# EAGLE schematic SmartRock_4-pin_EC_Breakout-v4 (EAGLE 9.6.2)
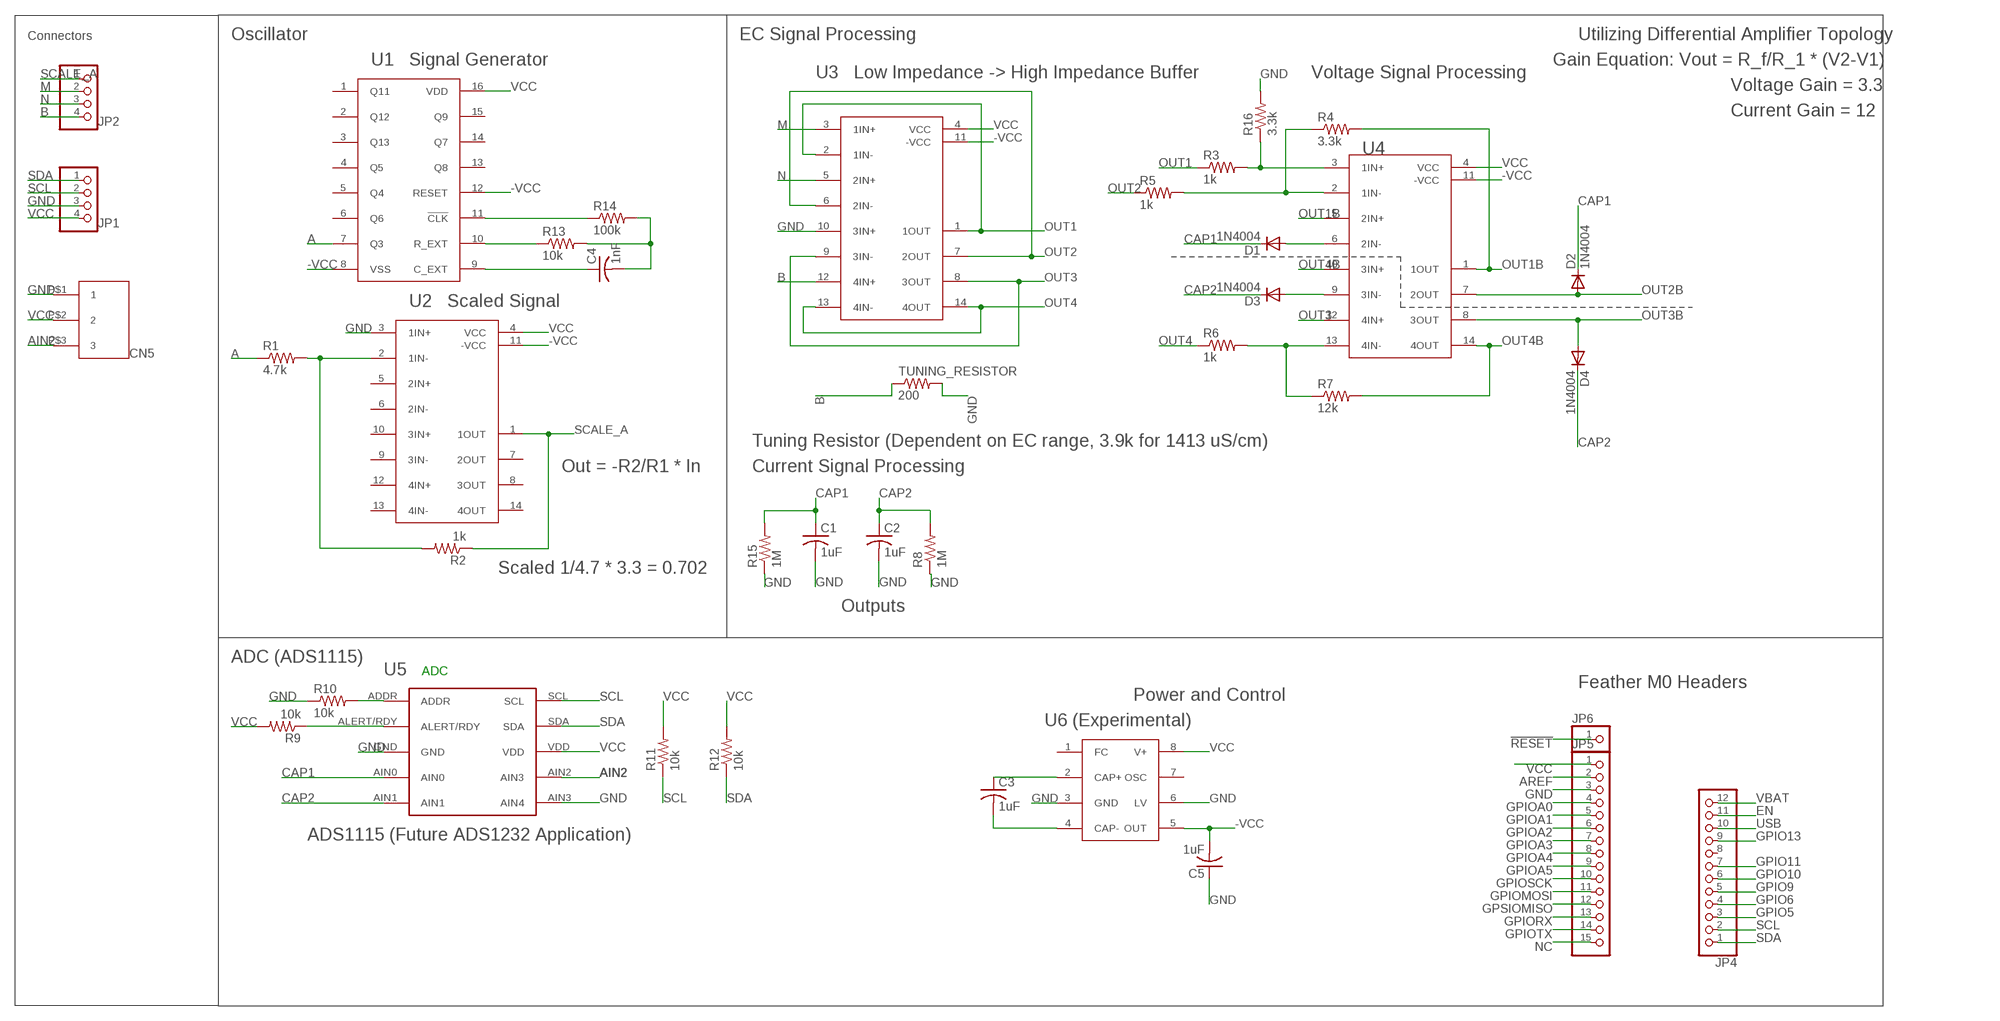
[diagram p0: schematic, sheet 1]

## Parts
C1  1uF  C-US025-024X044  [C025-024X044]
C2  1uF  C-US025-024X044  [C025-024X044]
C3  1uF  C-US025-024X044  [C025-024X044]
C4  1nF  C-USC1206  [C1206]
C5  1uF  C-US025-024X044  [C025-024X044]
CN2  JST_3PIN_2MM  [JST_3PIN_2MM]
D1  1N4004  [DO41-10]
D2  1N4004  [DO41-10]
D3  1N4004  [DO41-10]
D4  1N4004  [DO41-10]
JP1  PINHD-1X4  [1X04]
JP2  PINHD-1X4  [1X04]
JP4  PINHD-1X12-CB  [1X12-CB]
JP5  PINHD-1X15-CB  [1X15-CB]
JP6  PINHD-1X1CB  [1X01-CLEANBIG]
R1  4.7k  R-US_M1206  [M1206]
R2  1k  R-US_M1206  [M1206]
R3  1k  R-US_M1206  [M1206]
R4  3.3k  R-US_M1206  [M1206]
R5  1k  R-US_M1206  [M1206]
R6  1k  R-US_M1206  [M1206]
R7  12k  R-US_M1206  [M1206]
R8  1M  R-US_M1206  [M1206]
R9  10k  R-US_M1206  [M1206]
R10  10k  R-US_M1206  [M1206]
R11  10k  R-US_M1206  [M1206]
R12  10k  R-US_M1206  [M1206]
R13  10k  R-US_M1206  [M1206]
R14  100k  R-US_M1206  [M1206]
R15  1M  R-US_M1206  [M1206]
R16  3.3k  R-US_M1206  [M1206]
TUNING_RESISTOR  200  R-US_M1206  [M1206]
U1  CD4060BPWR  [CD4060BPWR]
U2  TL074CPWR  [LT074CPWR]
U3  TL074CPWR  [LT074CPWR]
U4  TL074CPWR  [LT074CPWR]
U5  ADS1115  [ADS1115]
U6+  MAX660MX/NOPB  [MAX660MX/NOPB]

## Nets
!RESET: JP6.1
-VCC: C5.2 U1.8(VSS) U1.12(RESET) U2.11(-VCC) U3.11(-VCC) U4.11(-VCC) U6+.5(OUT)
A: R1.1 U1.7(Q3)
AIN2: CN2.P$3 U5.AIN2(AIN3)
AREF: JP5.2
B: JP2.4 TUNING_RESISTOR.1 U3.12(4IN+)
CAP1: C1.1 D1.C D2.C R15.2 U5.AIN0
CAP2: C2.1 D3.C D4.C R8.2 U5.AIN1
EN: JP4.11
GND: C1.2 C2.2 C5.1 CN2.P$1 JP1.3 JP5.3 R8.1 R10.1 R15.1 R16.2 TUNING_RESISTOR.2 U2.3(1IN+) U3.10(3IN+) U5.AIN3(AIN4) U5.GND U6+.3(GND) U6+.6(LV)
GPIO5: JP4.3
GPIO6: JP4.4
GPIO9: JP4.5
GPIO10: JP4.6
GPIO11: JP4.7
GPIO13: JP4.9
GPIOA0: JP5.4
GPIOA1: JP5.5
GPIOA2: JP5.6
GPIOA3: JP5.7
GPIOA4: JP5.8
GPIOA5: JP5.9
GPIOMOSI: JP5.11
GPIORX: JP5.13
GPIOSCK: JP5.10
GPIOTX: JP5.14
GPSIOMISO: JP5.12
M: JP2.2 U3.3(1IN+)
N: JP2.3 U3.5(2IN+)
N$1: R3.2 R16.1 U4.3(1IN+)
N$2: R4.1 R5.2 U4.2(1IN-)
N$3: R1.2 R2.2 U2.2(1IN-)
N$4: D1.A U4.6(2IN-)
N$5: R6.2 R7.1 U4.13(4IN-)
N$6: D3.A U4.9(3IN-)
N$7: C3.1 U6+.2(CAP+)
N$8: C3.2 U6+.4(CAP-)
N$10: C4.1 U1.9(C_EXT)
N$11: R13.1 U1.10(R_EXT)
N$12: R14.1 U1.11(!CLK)
N$13: R10.2 U5.ADDR
N$15: R9.1 U5.ALERT/RDY
N$17: C4.2 R13.2 R14.2
NC: JP5.15
OUT1: R3.1 U3.1(1OUT) U3.2(1IN-)
OUT1B: R4.2 U4.1(1OUT) U4.5(2IN+)
OUT2: R5.1 U3.6(2IN-) U3.7(2OUT)
OUT2B: D2.A U4.7(2OUT)
OUT3: U3.8(3OUT) U3.9(3IN-) U4.12(4IN+)
OUT3B: D4.A U4.8(3OUT)
OUT4: R6.1 U3.13(4IN-) U3.14(4OUT)
OUT4B: R7.2 U4.10(3IN+) U4.14(4OUT)
SCALE_A: JP2.1 R2.1 U2.1(1OUT)
SCL: JP1.2 JP4.2 R11.1 U5.SCL
SDA: JP1.1 JP4.1 R12.1 U5.SDA
USB: JP4.10
VBAT: JP4.12
VCC: CN2.P$2 JP1.4 JP5.1 R9.2 R11.2 R12.2 U1.16(VDD) U2.4(VCC) U3.4(VCC) U4.4(VCC) U5.VDD U6+.8(V+)
Unconnected: JP4.8 U1.1(Q11) U1.2(Q12) U1.3(Q13) U1.4(Q5) U1.5(Q4) U1.6(Q6) U1.13(Q8) U1.14(Q7) U1.15(Q9) U2.5(2IN+) U2.6(2IN-) U2.7(2OUT) U2.8(3OUT) U2.9(3IN-) U2.10(3IN+) U2.12(4IN+) U2.13(4IN-) U2.14(4OUT) U6+.1(FC) U6+.7(OSC)

## Notes on the sheet
- Connectors | Oscillator | EC Signal Processing | Utilizing Differential Amplifier Topology
- U1 | Signal Generator | Gain Equation: Vout = R_f/R_1 * (V2-V1)
- U3 | Low Impedance -> High Impedance Buffer | Voltage Signal Processing
- Voltage Gain = 3.3
- Current Gain = 12
- U4
- U2 | Scaled Signal
- CN5
- Tuning Resistor (Dependent on EC range, 3.9k for 1413 uS/cm)
- Out = -R2/R1 * In | Current Signal Processing
- Scaled 1/4.7 * 3.3 = 0.702
- Outputs
- ADC (ADS1115)
- U5 | ADC
- Feather M0 Headers
- Power and Control
- U6 (Experimental)
- ADS1115 (Future ADS1232 Application)

## Library data of the parts
C1-C5 = adafruit:C-US: CAPACITOR, American symbol
CN2 = JSTconnector:JST_3PIN_2MM
D1-D4 = adafruit:1N4004: DIODE General purpose 1N400x type rectifier (With bigger pads) http://www.ladyada.net/library/pcb/eaglelibrary.html
JP1 JP2 = pinhead:PINHD-1X4: PIN HEADER
JP4 = adafruit:PINHD-1X12: PIN HEADER
JP5 = adafruit:PINHD-1X15: PIN HEADER
JP6 = adafruit:PINHD-1X1: Pin header 1x1 for 0.1" spacing With round pins
R1-R16 TUNING_RESISTOR = adafruit:R-US_: RESISTOR, American symbol
U1 = PNNL_Wenner:CD4060BPWR
U2-U4 = PNNL_Wenner:TL074CPWR
U5 = my_lib:ADS1115
U6+ = PNNL_Wenner:MAX660MX/NOPB

## Net classes
0 default: width 0.305 mm